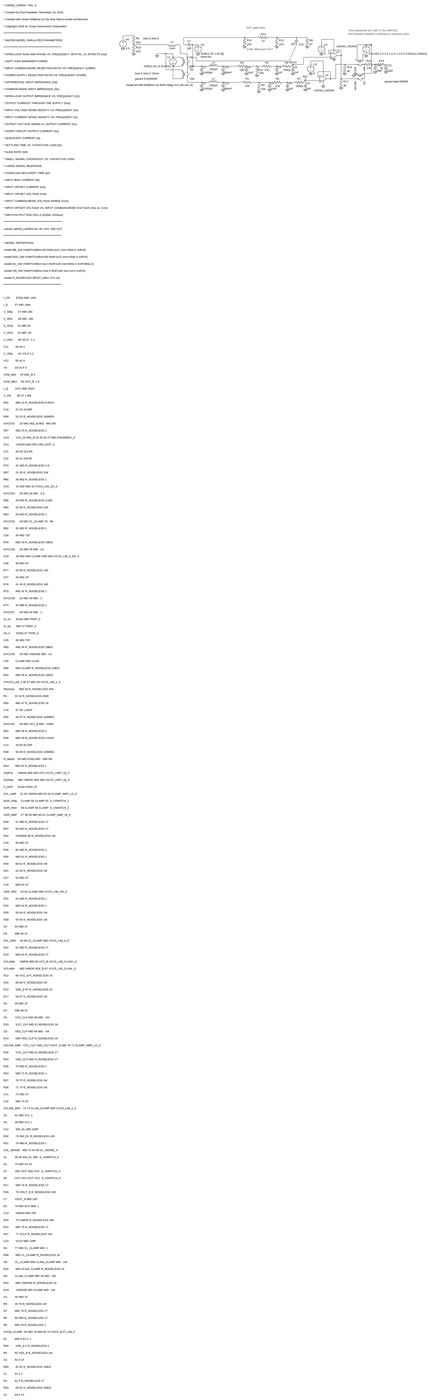
[diagram p0: schematic VNA201 8.asc, whole sheet]
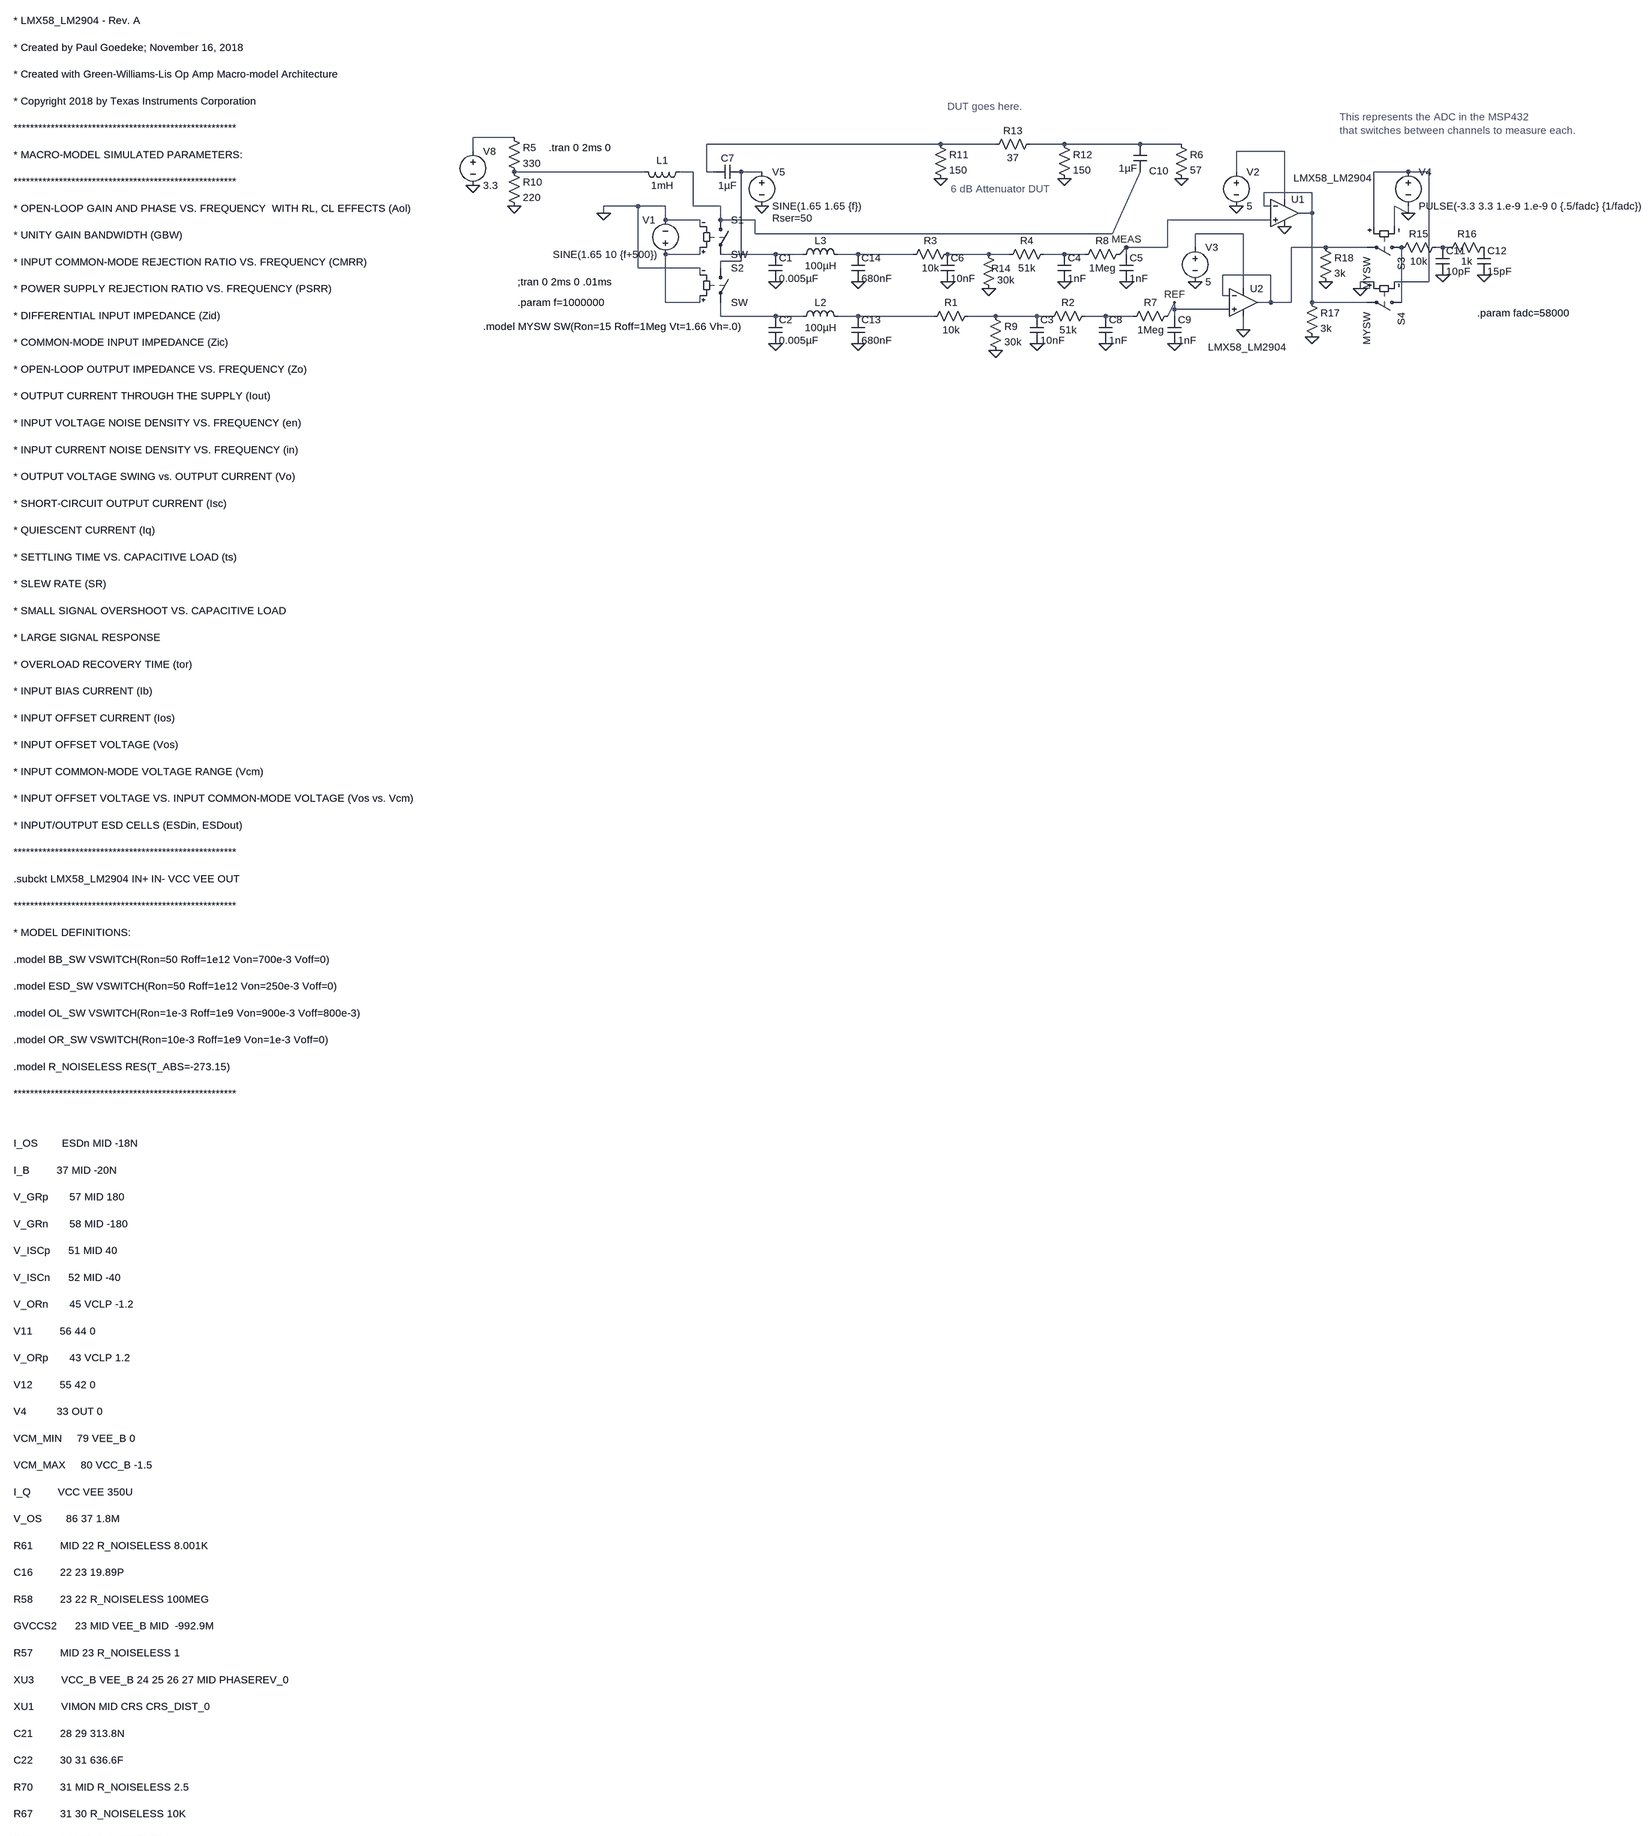
[diagram p1: schematic VNA201 8.asc, part, row 1 of 3, column 1 of 1]
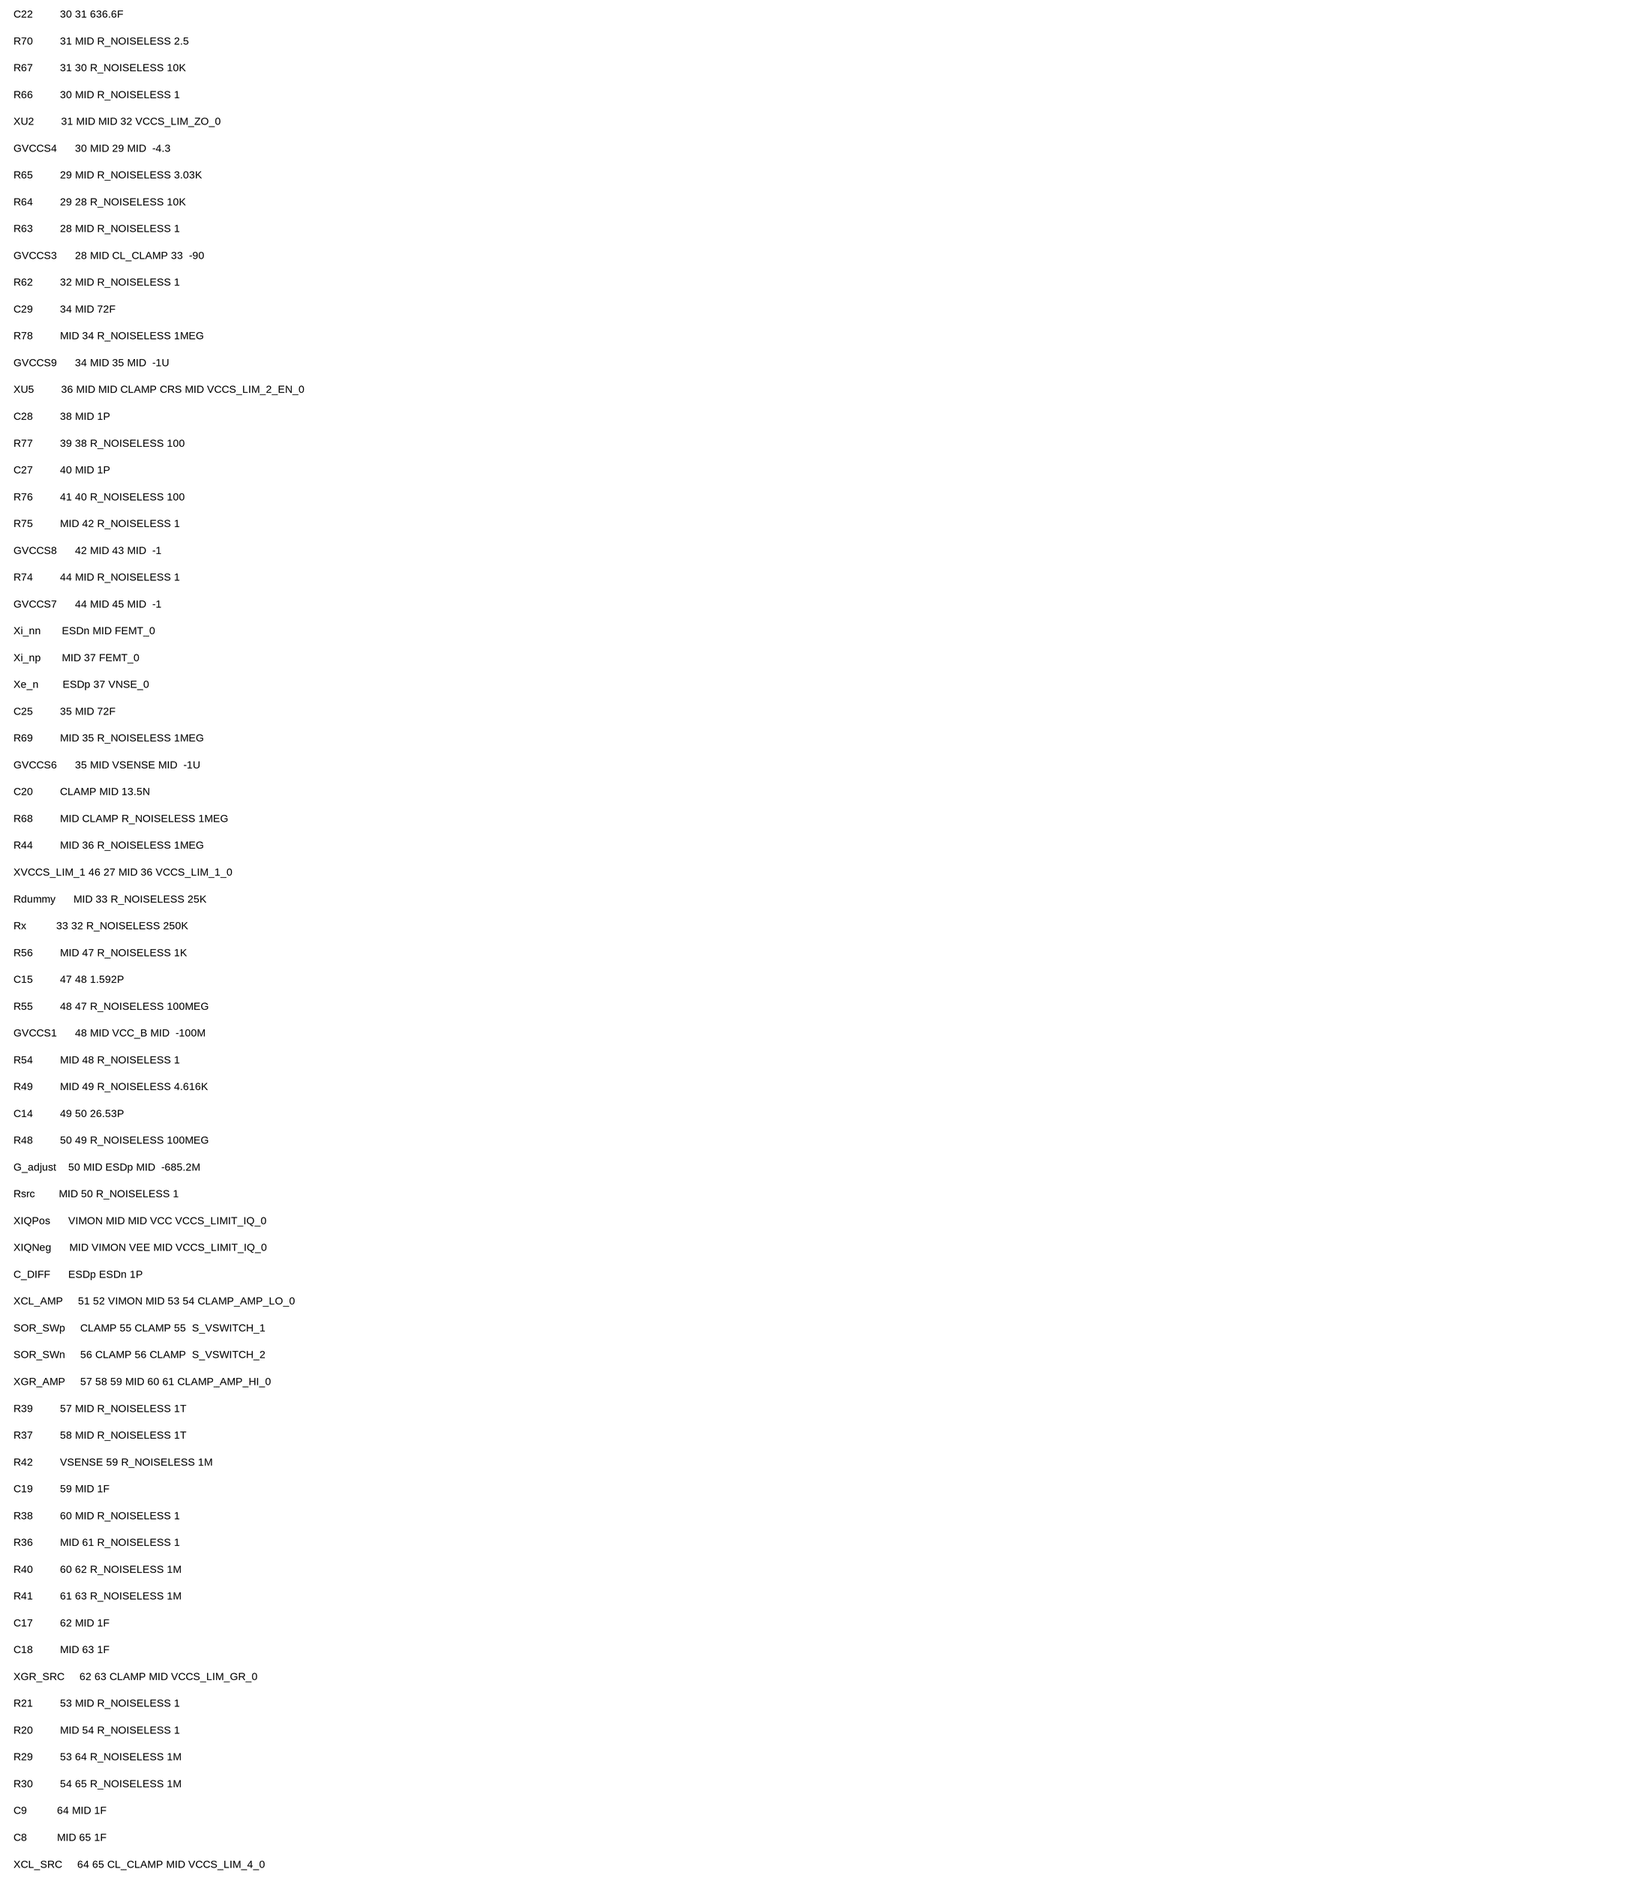
[diagram p2: schematic VNA201 8.asc, part, row 2 of 3, column 1 of 1]
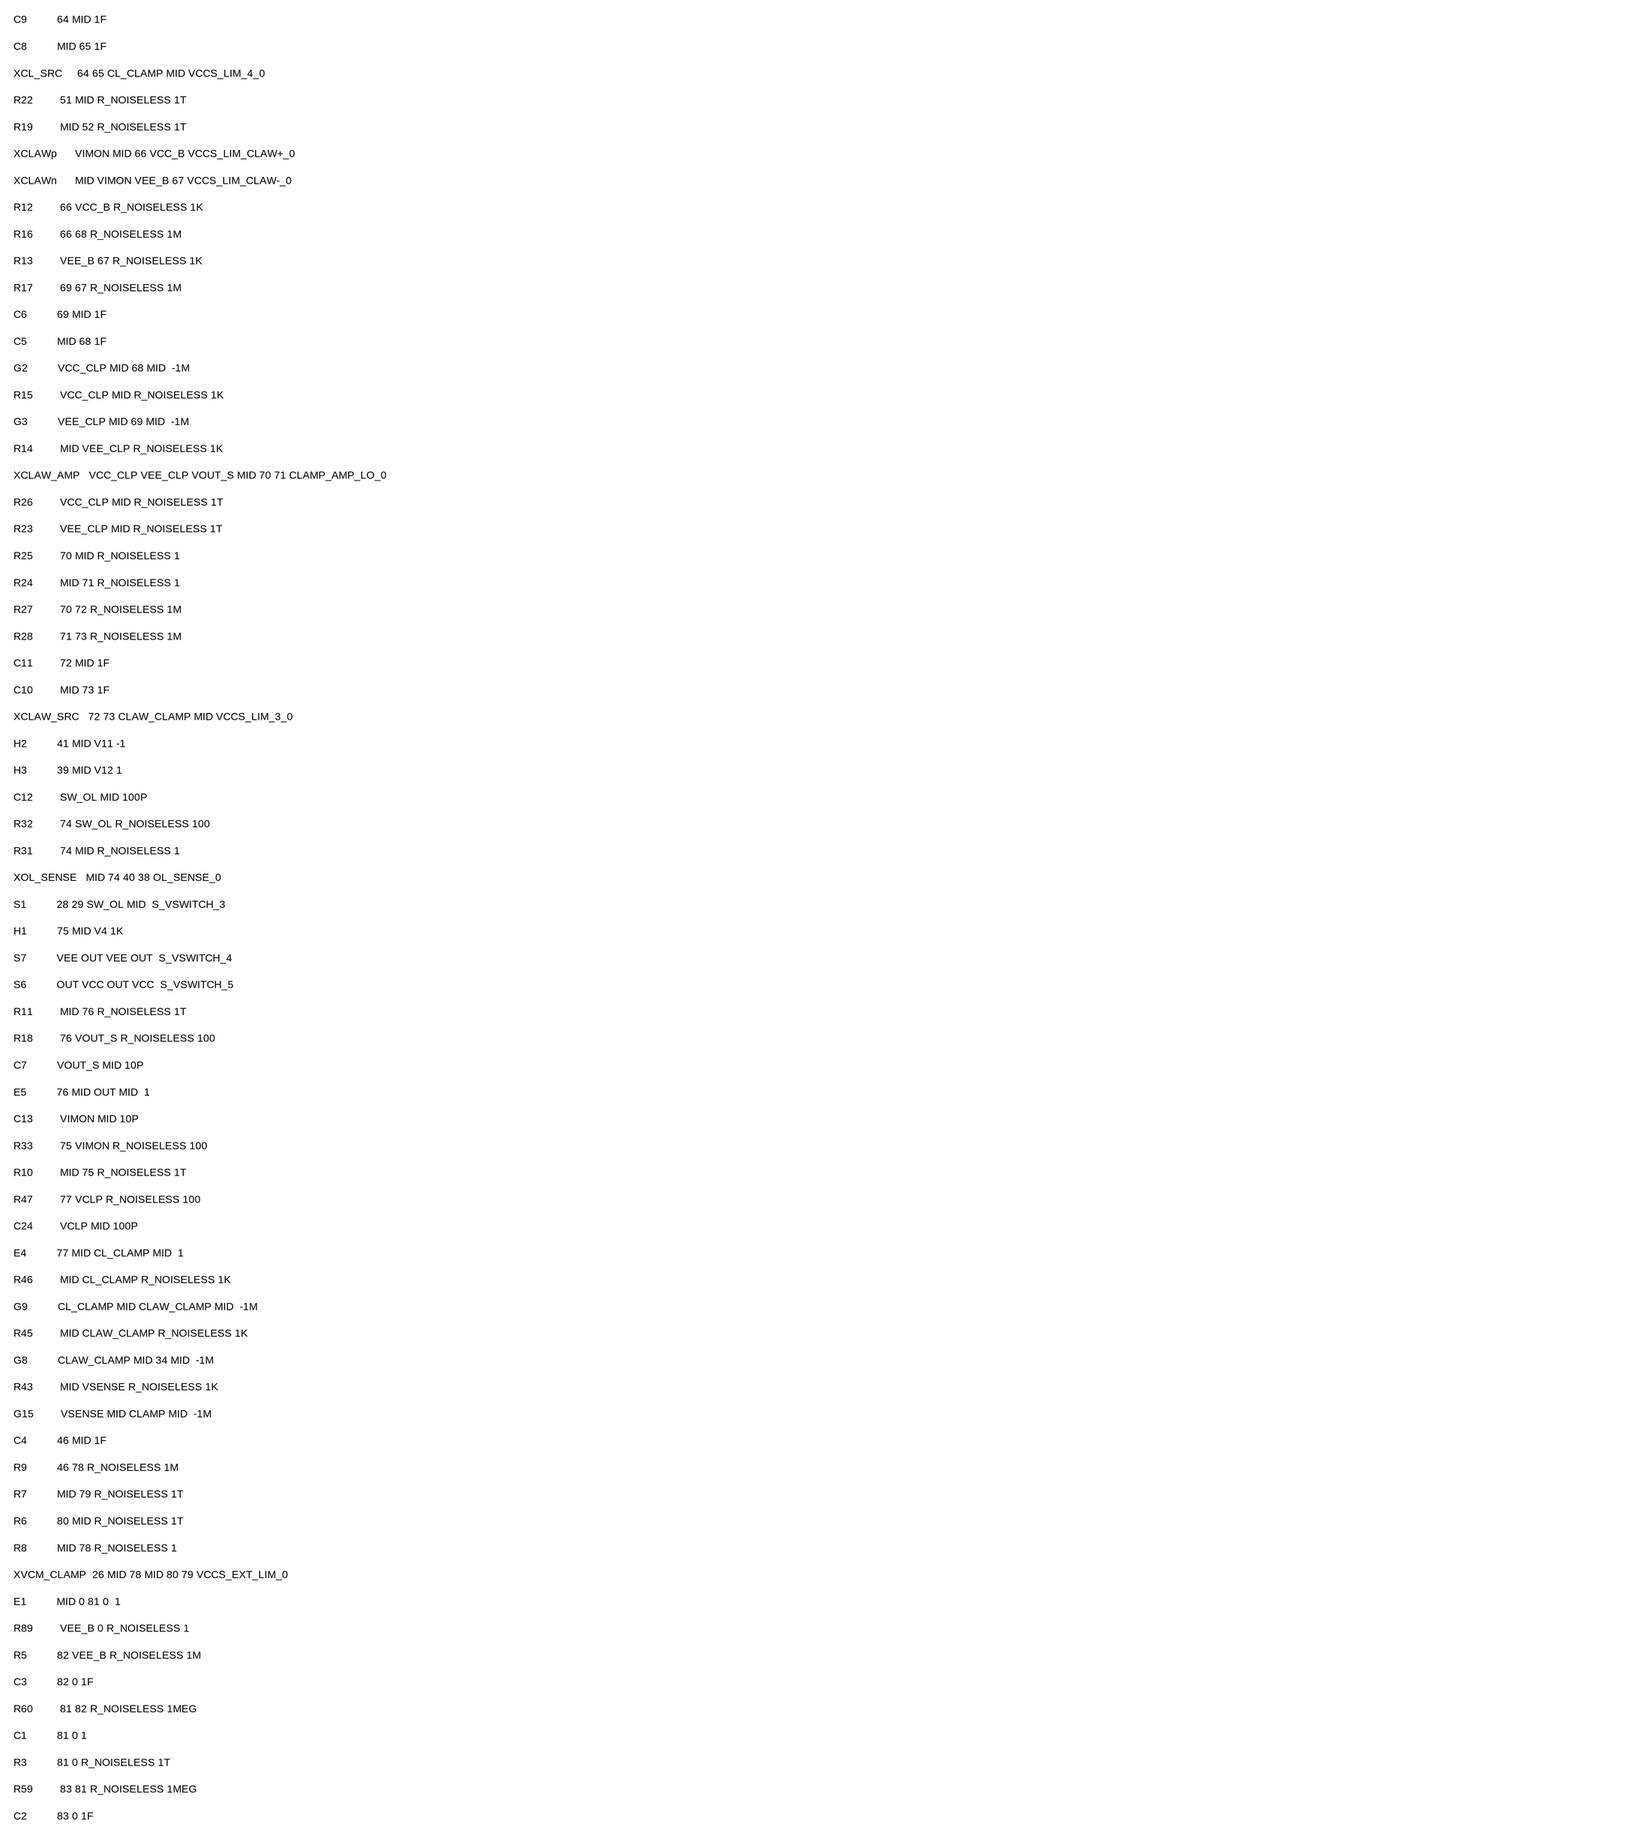
[diagram p3: schematic VNA201 8.asc, part, row 3 of 3, column 1 of 1]
VNA201 8.asc, the LTspice schematic file:
Version 4
SHEET 1 2392 10460
WIRE -624 -96 -720 -96
WIRE 368 -80 -176 -80
WIRE 496 -80 368 -80
WIRE 656 -80 576 -80
WIRE 832 -80 656 -80
WIRE 928 -80 832 -80
WIRE -720 -64 -720 -96
WIRE 1168 -64 1056 -64
WIRE -320 -16 -624 -16
WIRE -208 -16 -240 -16
WIRE -176 -16 -176 -80
WIRE -160 -16 -176 -16
WIRE -48 -16 -96 -16
WIRE 1056 -16 1056 -64
WIRE 1456 -16 1376 -16
WIRE 1504 -16 1456 -16
WIRE 1232 32 1120 32
WIRE 1168 48 1168 -64
WIRE -336 64 -416 64
WIRE -272 64 -336 64
WIRE -208 64 -208 -16
WIRE -144 64 -208 64
WIRE 1120 64 1120 32
WIRE 1136 64 1120 64
WIRE -416 80 -416 64
WIRE 1232 80 1232 32
WIRE 1232 80 1200 80
WIRE 1456 80 1424 64
WIRE 1456 80 1456 64
WIRE -272 96 -272 64
WIRE -192 96 -272 96
WIRE -144 96 -144 64
WIRE -64 96 -144 96
WIRE 1136 96 896 96
WIRE -192 112 -192 96
WIRE 1376 112 1376 -16
WIRE 1424 112 1424 64
WIRE -64 128 -64 96
WIRE 768 128 832 -16
WIRE 768 128 -64 128
WIRE 1072 128 960 128
WIRE 896 160 896 96
WIRE 896 160 800 160
WIRE 960 160 960 128
WIRE 1264 160 1184 160
WIRE 1360 160 1264 160
WIRE 1536 160 1520 160
WIRE 1552 160 1536 160
WIRE -192 176 -192 160
WIRE -192 176 -272 176
WIRE -16 176 -144 176
WIRE 48 176 -16 176
WIRE 176 176 128 176
WIRE 304 176 176 176
WIRE 480 176 384 176
WIRE 528 176 480 176
WIRE 656 176 608 176
WIRE 704 176 656 176
WIRE 784 176 800 160
WIRE 800 176 800 160
WIRE -96 192 -96 -16
WIRE -96 192 -144 192
WIRE -336 208 -336 64
WIRE -192 208 -336 208
WIRE -144 208 -144 192
WIRE -192 224 -192 208
WIRE 1136 224 1024 224
WIRE 1376 240 1344 240
WIRE 1504 240 1504 -16
WIRE 1504 240 1424 240
WIRE 1072 256 1072 128
WIRE 1344 256 1344 240
WIRE 1024 272 1024 224
WIRE 1040 272 1024 272
WIRE -272 288 -272 176
WIRE -192 288 -192 272
WIRE -192 288 -272 288
WIRE 1136 288 1136 224
WIRE 1136 288 1104 288
WIRE 1184 288 1184 160
WIRE 1184 288 1136 288
WIRE 1232 288 1232 80
WIRE 1360 288 1232 288
WIRE 1440 288 1440 160
WIRE 912 304 912 288
WIRE 1040 304 912 304
WIRE -144 320 -144 288
WIRE -16 320 -144 320
WIRE 48 320 -16 320
WIRE 176 320 128 320
WIRE 352 320 176 320
WIRE 496 320 432 320
WIRE 592 320 496 320
WIRE 624 320 592 320
WIRE 752 320 704 320
WIRE 816 320 752 320
WIRE 896 320 912 288
WIRE 912 320 912 304
WIRE 1072 352 1072 320
FLAG -16 384 0
FLAG -48 64 0
FLAG -416 80 0
FLAG -720 16 0
FLAG -16 240 0
FLAG 592 384 0
FLAG 752 384 0
FLAG 912 384 0
FLAG 656 240 0
FLAG 800 240 0
FLAG 384 240 0
FLAG 800 160 MEAS
FLAG 912 288 REF
FLAG -624 64 0
FLAG 656 0 0
FLAG 368 0 0
FLAG 928 0 0
FLAG 496 400 0
FLAG 480 256 0
FLAG 1168 112 0
FLAG 1056 64 0
FLAG 1072 352 0
FLAG 960 240 0
FLAG 1536 224 0
FLAG 1632 224 0
FLAG 1456 80 0
FLAG 1344 256 0
FLAG 1264 240 0
FLAG 1232 368 0
FLAG 176 384 0
FLAG 176 240 0
SYMBOL sw -144 80 R0
SYMATTR InstName S1
SYMATTR SpiceModel MYSW
SYMBOL sw -144 192 R0
SYMATTR InstName S2
SYMATTR SpiceModel MYSW
SYMBOL voltage -272 192 R180
WINDOW 0 24 96 Left 2
WINDOW 3 24 16 Left 2
WINDOW 123 0 0 Left 2
WINDOW 39 0 0 Left 2
SYMATTR InstName V1
SYMATTR Value SINE(1.65 10 {f+500})
SYMBOL cap -32 176 R0
SYMATTR InstName C1
SYMATTR Value 0.005µF
SYMBOL cap -32 320 R0
SYMATTR InstName C2
SYMATTR Value 0.005µF
SYMBOL voltage -48 -32 R0
WINDOW 123 0 0 Left 2
WINDOW 39 24 124 Left 2
SYMATTR SpiceLine Rser=50
SYMATTR InstName V5
SYMATTR Value SINE(1.65 1.65 {f})
SYMBOL res 448 304 R90
WINDOW 0 0 56 VBottom 2
WINDOW 3 32 56 VTop 2
SYMATTR InstName R1
SYMATTR Value 10k
SYMBOL res 400 160 R90
WINDOW 0 0 56 VBottom 2
WINDOW 3 32 56 VTop 2
SYMATTR InstName R3
SYMATTR Value 10k
SYMBOL voltage -720 -80 R0
WINDOW 123 0 0 Left 2
WINDOW 39 0 0 Left 2
SYMATTR InstName V8
SYMATTR Value 3.3
SYMBOL res -640 -112 R0
SYMATTR InstName R5
SYMATTR Value 330
SYMBOL cap -96 -32 R90
WINDOW 0 0 32 VBottom 2
WINDOW 3 32 32 VTop 2
SYMATTR InstName C7
SYMATTR Value 1µF
SYMBOL ind -224 -32 R90
WINDOW 0 5 56 VBottom 2
WINDOW 3 32 56 VTop 2
SYMATTR InstName L1
SYMATTR Value 1mH
SYMATTR SpiceLine Ipk=0.43 Rser=2.58 Rpar=94200 Cpar=0
SYMBOL cap 736 320 R0
SYMATTR InstName C8
SYMATTR Value 1nF
SYMBOL cap 896 320 R0
SYMATTR InstName C9
SYMATTR Value 1nF
SYMBOL res 720 304 R90
WINDOW 0 0 56 VBottom 2
WINDOW 3 32 56 VTop 2
SYMATTR InstName R2
SYMATTR Value 51k
SYMBOL res 912 304 R90
WINDOW 0 0 56 VBottom 2
WINDOW 3 32 56 VTop 2
SYMATTR InstName R7
SYMATTR Value 1Meg
SYMBOL cap 640 176 R0
SYMATTR InstName C4
SYMATTR Value 1nF
SYMBOL cap 784 176 R0
SYMATTR InstName C5
SYMATTR Value 1nF
SYMBOL res 624 160 R90
WINDOW 0 0 56 VBottom 2
WINDOW 3 32 56 VTop 2
SYMATTR InstName R4
SYMATTR Value 51k
SYMBOL res 800 160 R90
WINDOW 0 0 56 VBottom 2
WINDOW 3 32 56 VTop 2
SYMATTR InstName R8
SYMATTR Value 1Meg
SYMBOL cap 368 176 R0
SYMATTR InstName C6
SYMATTR Value 10nF
SYMBOL cap 576 320 R0
SYMATTR InstName C3
SYMATTR Value 10nF
SYMBOL res -640 -32 R0
SYMATTR InstName R10
SYMATTR Value 220
SYMBOL res 352 -96 R0
SYMATTR InstName R11
SYMATTR Value 150
SYMBOL res 640 -96 R0
SYMATTR InstName R12
SYMATTR Value 150
SYMBOL res 592 -96 R90
WINDOW 0 0 56 VBottom 2
WINDOW 3 32 56 VTop 2
SYMATTR InstName R13
SYMATTR Value 37
SYMBOL cap 848 -16 R180
WINDOW 0 -49 2 Left 2
WINDOW 3 24 8 Left 2
SYMATTR InstName C10
SYMATTR Value 1µF
SYMBOL res 912 -96 R0
SYMATTR InstName R6
SYMATTR Value 57
SYMBOL res 480 304 R0
SYMATTR InstName R9
SYMATTR Value 30k
SYMBOL res 464 160 R0
WINDOW 0 22 49 Left 2
SYMATTR InstName R14
SYMATTR Value 30k
SYMBOL Opamps\\opamp2 1168 16 R0
WINDOW 3 21 -18 Left 2
SYMATTR Value LMX58_LM2904
SYMATTR InstName U1
SYMBOL Opamps\\opamp2 1072 224 R0
WINDOW 3 -82 168 Left 2
SYMATTR Value LMX58_LM2904
SYMATTR InstName U2
SYMBOL voltage 1056 -32 R0
WINDOW 123 0 0 Left 0
WINDOW 39 0 0 Left 0
SYMATTR InstName V2
SYMATTR Value 5
SYMBOL voltage 960 144 R0
WINDOW 123 0 0 Left 0
WINDOW 39 0 0 Left 0
SYMATTR InstName V3
SYMATTR Value 5
SYMBOL res 1536 144 R90
WINDOW 0 0 56 VBottom 2
WINDOW 3 32 56 VTop 2
SYMATTR InstName R15
SYMATTR Value 10k
SYMBOL cap 1520 160 R0
SYMATTR InstName C11
SYMATTR Value 10pF
SYMBOL cap 1616 160 R0
SYMATTR InstName C12
SYMATTR Value 15pF
SYMBOL res 1648 144 R90
WINDOW 0 0 56 VBottom 2
WINDOW 3 32 56 VTop 2
SYMATTR InstName R16
SYMATTR Value 1k
SYMBOL sw 1456 160 R90
SYMATTR InstName S3
SYMATTR Value MYSW
SYMBOL sw 1456 288 R90
SYMATTR InstName S4
SYMATTR Value MYSW
SYMBOL voltage 1456 -32 R0
WINDOW 123 0 0 Left 0
WINDOW 39 0 0 Left 0
SYMATTR InstName V4
SYMATTR Value PULSE(-3.3 3.3 1.e-9 1.e-9 0 {.5/fadc} {1/fadc})
SYMBOL res 1216 272 R0
SYMATTR InstName R17
SYMATTR Value 3k
SYMBOL res 1248 144 R0
SYMATTR InstName R18
SYMATTR Value 3k
SYMBOL ind 32 336 R270
WINDOW 0 32 56 VTop 2
WINDOW 3 5 56 VBottom 2
SYMATTR InstName L2
SYMATTR Value 100µH
SYMBOL ind 32 192 R270
WINDOW 0 32 56 VTop 2
WINDOW 3 5 56 VBottom 2
SYMATTR InstName L3
SYMATTR Value 100µH
SYMBOL cap 160 320 R0
SYMATTR InstName C13
SYMATTR Value 680nF
SYMBOL cap 160 176 R0
SYMATTR InstName C14
SYMATTR Value 680nF
TEXT -544 -72 Left 2 !.tran 0 2ms 0
TEXT -616 240 Left 2 !;tran 0 2ms 0 .01ms
TEXT 384 -168 Left 2 ;DUT goes here.
TEXT -616 288 Left 2 !.param f=1000000
TEXT -696 344 Left 2 !.model MYSW SW(Ron=15 Roff=1Meg Vt=1.66 Vh=.0)
TEXT 392 24 Left 2 ;6 dB Attenuator DUT
TEXT -1832 -368 Left 2 !* LMX58_LM2904 - Rev. A\n\n* Created by Paul Goedeke; November 16, 2018\n\n* Created with Green-Williams-Lis Op Amp Macro-model Architecture\n\n* Copyright 2018 by Texas Instruments Corporation\n\n******************************************************\n\n* MACRO-MODEL SIMULATED PARAMETERS:\n\n******************************************************\n\n* OPEN-LOOP GAIN AND PHASE VS. FREQUENCY  WITH RL, CL EFFECTS (Aol)\n\n* UNITY GAIN BANDWIDTH (GBW)\n\n* INPUT COMMON-MODE REJECTION RATIO VS. FREQUENCY (CMRR)\n\n* POWER SUPPLY REJECTION RATIO VS. FREQUENCY (PSRR)\n\n* DIFFERENTIAL INPUT IMPEDANCE (Zid)\n\n* COMMON-MODE INPUT IMPEDANCE (Zic)\n\n* OPEN-LOOP OUTPUT IMPEDANCE VS. FREQUENCY (Zo)\n\n* OUTPUT CURRENT THROUGH THE SUPPLY (Iout)\n\n* INPUT VOLTAGE NOISE DENSITY VS. FREQUENCY (en)\n\n* INPUT CURRENT NOISE DENSITY VS. FREQUENCY (in)\n\n* OUTPUT VOLTAGE SWING vs. OUTPUT CURRENT (Vo)\n\n* SHORT-CIRCUIT OUTPUT CURRENT (Isc)\n\n* QUIESCENT CURRENT (Iq)\n\n* SETTLING TIME VS. CAPACITIVE LOAD (ts)\n\n* SLEW RATE (SR)\n\n* SMALL SIGNAL OVERSHOOT VS. CAPACITIVE LOAD\n\n* LARGE SIGNAL RESPONSE\n\n* OVERLOAD RECOVERY TIME (tor)\n\n* INPUT BIAS CURRENT (Ib)\n\n* INPUT OFFSET CURRENT (Ios)\n\n* INPUT OFFSET VOLTAGE (Vos)\n\n* INPUT COMMON-MODE VOLTAGE RANGE (Vcm)\n\n* INPUT OFFSET VOLTAGE VS. INPUT COMMON-MODE VOLTAGE (Vos vs. Vcm)\n\n* INPUT/OUTPUT ESD CELLS (ESDin, ESDout)\n\n******************************************************\n\n.subckt LMX58_LM2904 IN+ IN- VCC VEE OUT\n\n******************************************************\n\n* MODEL DEFINITIONS:\n\n.model BB_SW VSWITCH(Ron=50 Roff=1e12 Von=700e-3 Voff=0)\n\n.model ESD_SW VSWITCH(Ron=50 Roff=1e12 Von=250e-3 Voff=0)\n\n.model OL_SW VSWITCH(Ron=1e-3 Roff=1e9 Von=900e-3 Voff=800e-3)\n\n.model OR_SW VSWITCH(Ron=10e-3 Roff=1e9 Von=1e-3 Voff=0)\n\n.model R_NOISELESS RES(T_ABS=-273.15)\n\n******************************************************\n\n\n\n\nI_OS        ESDn MID -18N\n\nI_B         37 MID -20N\n\nV_GRp       57 MID 180\n\nV_GRn       58 MID -180\n\nV_ISCp      51 MID 40\n\nV_ISCn      52 MID -40\n\nV_ORn       45 VCLP -1.2\n\nV11         56 44 0\n\nV_ORp       43 VCLP 1.2\n\nV12         55 42 0\n\nV4          33 OUT 0\n\nVCM_MIN     79 VEE_B 0\n\nVCM_MAX     80 VCC_B -1.5\n\nI_Q         VCC VEE 350U\n\nV_OS        86 37 1.8M\n\nR61         MID 22 R_NOISELESS 8.001K \n\nC16         22 23 19.89P \n\nR58         23 22 R_NOISELESS 100MEG \n\nGVCCS2      23 MID VEE_B MID  -992.9M\n\nR57         MID 23 R_NOISELESS 1 \n\nXU3         VCC_B VEE_B 24 25 26 27 MID PHASEREV_0\n\nXU1         VIMON MID CRS CRS_DIST_0\n\nC21         28 29 313.8N  \n\nC22         30 31 636.6F  \n\nR70         31 MID R_NOISELESS 2.5 \n\nR67         31 30 R_NOISELESS 10K \n\nR66         30 MID R_NOISELESS 1 \n\nXU2         31 MID MID 32 VCCS_LIM_ZO_0\n\nGVCCS4      30 MID 29 MID  -4.3\n\nR65         29 MID R_NOISELESS 3.03K \n\nR64         29 28 R_NOISELESS 10K \n\nR63         28 MID R_NOISELESS 1 \n\nGVCCS3      28 MID CL_CLAMP 33  -90\n\nR62         32 MID R_NOISELESS 1 \n\nC29         34 MID 72F \n\nR78         MID 34 R_NOISELESS 1MEG \n\nGVCCS9      34 MID 35 MID  -1U\n\nXU5         36 MID MID CLAMP CRS MID VCCS_LIM_2_EN_0\n\nC28         38 MID 1P \n\nR77         39 38 R_NOISELESS 100 \n\nC27         40 MID 1P \n\nR76         41 40 R_NOISELESS 100 \n\nR75         MID 42 R_NOISELESS 1 \n\nGVCCS8      42 MID 43 MID  -1\n\nR74         44 MID R_NOISELESS 1 \n\nGVCCS7      44 MID 45 MID  -1\n\nXi_nn       ESDn MID FEMT_0\n\nXi_np       MID 37 FEMT_0\n\nXe_n        ESDp 37 VNSE_0\n\nC25         35 MID 72F \n\nR69         MID 35 R_NOISELESS 1MEG \n\nGVCCS6      35 MID VSENSE MID  -1U\n\nC20         CLAMP MID 13.5N \n\nR68         MID CLAMP R_NOISELESS 1MEG \n\nR44         MID 36 R_NOISELESS 1MEG \n\nXVCCS_LIM_1 46 27 MID 36 VCCS_LIM_1_0\n\nRdummy      MID 33 R_NOISELESS 25K \n\nRx          33 32 R_NOISELESS 250K \n\nR56         MID 47 R_NOISELESS 1K \n\nC15         47 48 1.592P \n\nR55         48 47 R_NOISELESS 100MEG \n\nGVCCS1      48 MID VCC_B MID  -100M\n\nR54         MID 48 R_NOISELESS 1 \n\nR49         MID 49 R_NOISELESS 4.616K \n\nC14         49 50 26.53P \n\nR48         50 49 R_NOISELESS 100MEG \n\nG_adjust    50 MID ESDp MID  -685.2M\n\nRsrc        MID 50 R_NOISELESS 1 \n\nXIQPos      VIMON MID MID VCC VCCS_LIMIT_IQ_0\n\nXIQNeg      MID VIMON VEE MID VCCS_LIMIT_IQ_0\n\nC_DIFF      ESDp ESDn 1P \n\nXCL_AMP     51 52 VIMON MID 53 54 CLAMP_AMP_LO_0\n\nSOR_SWp     CLAMP 55 CLAMP 55  S_VSWITCH_1\n\nSOR_SWn     56 CLAMP 56 CLAMP  S_VSWITCH_2\n\nXGR_AMP     57 58 59 MID 60 61 CLAMP_AMP_HI_0\n\nR39         57 MID R_NOISELESS 1T \n\nR37         58 MID R_NOISELESS 1T \n\nR42         VSENSE 59 R_NOISELESS 1M \n\nC19         59 MID 1F \n\nR38         60 MID R_NOISELESS 1 \n\nR36         MID 61 R_NOISELESS 1 \n\nR40         60 62 R_NOISELESS 1M \n\nR41         61 63 R_NOISELESS 1M \n\nC17         62 MID 1F \n\nC18         MID 63 1F \n\nXGR_SRC     62 63 CLAMP MID VCCS_LIM_GR_0\n\nR21         53 MID R_NOISELESS 1 \n\nR20         MID 54 R_NOISELESS 1 \n\nR29         53 64 R_NOISELESS 1M \n\nR30         54 65 R_NOISELESS 1M \n\nC9          64 MID 1F \n\nC8          MID 65 1F \n\nXCL_SRC     64 65 CL_CLAMP MID VCCS_LIM_4_0\n\nR22         51 MID R_NOISELESS 1T \n\nR19         MID 52 R_NOISELESS 1T \n\nXCLAWp      VIMON MID 66 VCC_B VCCS_LIM_CLAW+_0\n\nXCLAWn      MID VIMON VEE_B 67 VCCS_LIM_CLAW-_0\n\nR12         66 VCC_B R_NOISELESS 1K \n\nR16         66 68 R_NOISELESS 1M \n\nR13         VEE_B 67 R_NOISELESS 1K \n\nR17         69 67 R_NOISELESS 1M \n\nC6          69 MID 1F \n\nC5          MID 68 1F \n\nG2          VCC_CLP MID 68 MID  -1M\n\nR15         VCC_CLP MID R_NOISELESS 1K \n\nG3          VEE_CLP MID 69 MID  -1M\n\nR14         MID VEE_CLP R_NOISELESS 1K \n\nXCLAW_AMP   VCC_CLP VEE_CLP VOUT_S MID 70 71 CLAMP_AMP_LO_0\n\nR26         VCC_CLP MID R_NOISELESS 1T \n\nR23         VEE_CLP MID R_NOISELESS 1T \n\nR25         70 MID R_NOISELESS 1 \n\nR24         MID 71 R_NOISELESS 1 \n\nR27         70 72 R_NOISELESS 1M \n\nR28         71 73 R_NOISELESS 1M \n\nC11         72 MID 1F \n\nC10         MID 73 1F \n\nXCLAW_SRC   72 73 CLAW_CLAMP MID VCCS_LIM_3_0\n\nH2          41 MID V11 -1\n\nH3          39 MID V12 1\n\nC12         SW_OL MID 100P \n\nR32         74 SW_OL R_NOISELESS 100 \n\nR31         74 MID R_NOISELESS 1 \n\nXOL_SENSE   MID 74 40 38 OL_SENSE_0\n\nS1          28 29 SW_OL MID  S_VSWITCH_3\n\nH1          75 MID V4 1K\n\nS7          VEE OUT VEE OUT  S_VSWITCH_4\n\nS6          OUT VCC OUT VCC  S_VSWITCH_5\n\nR11         MID 76 R_NOISELESS 1T \n\nR18         76 VOUT_S R_NOISELESS 100 \n\nC7          VOUT_S MID 10P \n\nE5          76 MID OUT MID  1\n\nC13         VIMON MID 10P \n\nR33         75 VIMON R_NOISELESS 100 \n\nR10         MID 75 R_NOISELESS 1T \n\nR47         77 VCLP R_NOISELESS 100 \n\nC24         VCLP MID 100P \n\nE4          77 MID CL_CLAMP MID  1\n\nR46         MID CL_CLAMP R_NOISELESS 1K \n\nG9          CL_CLAMP MID CLAW_CLAMP MID  -1M\n\nR45         MID CLAW_CLAMP R_NOISELESS 1K \n\nG8          CLAW_CLAMP MID 34 MID  -1M\n\nR43         MID VSENSE R_NOISELESS 1K \n\nG15         VSENSE MID CLAMP MID  -1M\n\nC4          46 MID 1F \n\nR9          46 78 R_NOISELESS 1M \n\nR7          MID 79 R_NOISELESS 1T \n\nR6          80 MID R_NOISELESS 1T \n\nR8          MID 78 R_NOISELESS 1 \n\nXVCM_CLAMP  26 MID 78 MID 80 79 VCCS_EXT_LIM_0\n\nE1          MID 0 81 0  1\n\nR89         VEE_B 0 R_NOISELESS 1 \n\nR5          82 VEE_B R_NOISELESS 1M \n\nC3          82 0 1F \n\nR60         81 82 R_NOISELESS 1MEG \n\nC1          81 0 1 \n\nR3          81 0 R_NOISELESS 1T \n\nR59         83 81 R_NOISELESS 1MEG \n\nC2          83 0 1F \n\nR4          VCC_B 83 R_NOISELESS 1M \n\nR88         VCC_B 0 R_NOISELESS 1 \n\nG17         VEE_B 0 VEE 0  -1\n\nG16         VCC_B 0 VCC 0  -1\n\nR_PSR       84 24 R_NOISELESS 1K \n\nG_PSR       24 84 47 22  -1M\n\nR2          25 ESDn R_NOISELESS 1M \n\nR1          84 85 R_NOISELESS 1M \n\nR_CMR       86 85 R_NOISELESS 1K \n\nG_CMR       85 86 49 MID  -1M\n\nC_CMn       ESDn MID 2P \n\nC_CMp       MID ESDp 2P \n\nR53         ESDn MID R_NOISELESS 1T \n\nR52         MID ESDp R_NOISELESS 1T \n\nR35         IN- ESDn R_NOISELESS 10M \n\nR34         IN+ ESDp R_NOISELESS 10M \n\n\n.MODEL S_VSWITCH_1 VSWITCH (RON=10M ROFF=1T VON=10M VOFF=0)\n\n.MODEL S_VSWITCH_2 VSWITCH (RON=10M ROFF=1T VON=10M VOFF=0)\n\n.MODEL S_VSWITCH_3 VSWITCH (RON=1M ROFF=1T VON=500M VOFF=100M)\n\n.MODEL S_VSWITCH_4 VSWITCH (RON=50 ROFF=1T VON=500M VOFF=450M)\n\n.MODEL S_VSWITCH_5 VSWITCH (RON=50 ROFF=1T VON=500M VOFF=450M)\n\n\n.ENDS LMX58_LM2904\n\n*\n\n.SUBCKT PHASEREV_0  VCC VEE VIN+ VIN- VOUT+ VOUT- MID\n\nE1 VOUT+ MID VALUE={IF(V(VIN+,MID)<V(VEE,MID)-0.3,V(VCC,MID),V(VIN+,MID))}\n\nE2 VOUT- MID VALUE={IF(V(VIN-,MID)<V(VEE,MID)-0.3,V(VCC,MID),V(VIN-,MID))}\n\n.ENDS\n\n*\n\n\n\n\n.SUBCKT CRS_DIST_0  VIMON MID OUT\n\nV1 VREF MID -40M\n\nESHF VSHF MID VIMON VREF 1\n\nGZC MID ZC VALUE = {SGN(V(VSHF,MID))}\n\nR1 ZC MID 1\n\nC1 ZC MID 2U\n\nGCR MID OUT VALUE = {IF((ABS(V(ZC,MID))<=0.9),0,1)}\n\nR2 OUT MID 1\n\n.ENDS\n\n*\n\n\n\n\n.SUBCKT VCCS_LIM_ZO_0  VC+ VC- IOUT+ IOUT-\n\n.PARAM GAIN = 4E3\n\n.PARAM IPOS = 1E6\n\n.PARAM INEG = -1E6\n\nG1 IOUT+ IOUT- VALUE={LIMIT(GAIN*V(VC+,VC-),INEG,IPOS)}\n\n.ENDS\n\n*\n\n\n\n\n.SUBCKT VCCS_LIM_2_EN_0  VC+ VC- IOUT+ IOUT- EN MID\n\n.PARAM GAIN = 8.4E-4\n\n.PARAM IPOS = 0.005\n\n.PARAM INEG = -0.005\n\nG1 IOUT+ IOUT- VALUE={LIMIT(GAIN*V(EN,MID)*V(VC+,VC-),INEG,IPOS)}\n\n.ENDS\n\n*\n\n\n\n\n.SUBCKT FEMT_0  1 2\n\n.PARAM FLWF=1E-3\n\n.PARAM NLFF=500\n\n.PARAM NVRF=500\n\n.PARAM GLFF={PWR(FLWF,0.25)*NLFF/1164}\n\n.PARAM RNVF={1.184*PWR(NVRF,2)}\n\n.MODEL DVNF D KF={PWR(FLWF,0.5)/1E11} IS=1.0E-16\n\nI1 0 7 10E-3\n\nI2 0 8 10E-3\n\nD1 7 0 DVNF\n\nD2 8 0 DVNF\n\nE1 3 6 7 8 {GLFF}\n\nR1 3 0 1E9\n\nR2 3 0 1E9\n\nR3 3 6 1E9\n\nE2 6 4 5 0 10\n\nR4 5 0 {RNVF}\n\nR5 5 0 {RNVF}\n\nR6 3 4 1E9\n\nR7 4 0 1E9\n\nG1 1 2 3 4 1E-6\n\n.ENDS\n\n*\n\n\n\n\n.SUBCKT VNSE_0  1 2\n\n.PARAM FLW=10\n\n.PARAM NLF=80\n\n.PARAM NVR=35\n\n.PARAM GLF={PWR(FLW,0.25)*NLF/1164}\n\n.PARAM RNV={1.184*PWR(NVR,2)}\n\n.MODEL DVN D KF={PWR(FLW,0.5)/1E11} IS=1.0E-16\n\nI1 0 7 10E-3\n\nI2 0 8 10E-3\n\nD1 7 0 DVN\n\nD2 8 0 DVN\n\nE1 3 6 7 8 {GLF}\n\nR1 3 0 1E9\n\nR2 3 0 1E9\n\nR3 3 6 1E9\n\nE2 6 4 5 0 10\n\nR4 5 0 {RNV}\n\nR5 5 0 {RNV}\n\nR6 3 4 1E9\n\nR7 4 0 1E9\n\nE3 1 2 3 4 1\n\n.ENDS\n\n*\n\n\n\n\n.SUBCKT VCCS_LIM_1_0  VC+ VC- IOUT+ IOUT-\n\n.PARAM GAIN = 1E-4\n\n.PARAM IPOS = .5\n\n.PARAM INEG = -.5\n\nG1 IOUT+ IOUT- VALUE={LIMIT(GAIN*V(VC+,VC-),INEG,IPOS)}\n\n.ENDS\n\n*\n\n\n\n\n.SUBCKT VCCS_LIMIT_IQ_0  VC+ VC- IOUT+ IOUT-\n\n.PARAM GAIN = 1E-3\n\nG1 IOUT- IOUT+ VALUE={IF( (V(VC+,VC-)<=0),0,GAIN*V(VC+,VC-) )}\n\n.ENDS\n\n*\n\n\n\n\n.SUBCKT CLAMP_AMP_LO_0  VC+ VC- VIN COM VO+ VO-\n\n.PARAM G=1\n\nGVO+ COM VO+ VALUE = {IF(V(VIN,COM)>V(VC+,COM),((V(VIN,COM)-V(VC+,COM))*G),0)}\n\nGVO- COM VO- VALUE = {IF(V(VIN,COM)<V(VC-,COM),((V(VC-,COM)-V(VIN,COM))*G),0)}\n\n.ENDS\n\n*\n\n\n\n\n.SUBCKT CLAMP_AMP_HI_0  VC+ VC- VIN COM VO+ VO-\n\n.PARAM G=10\n\nGVO+ COM VO+ VALUE = {IF(V(VIN,COM)>V(VC+,COM),((V(VIN,COM)-V(VC+,COM))*G),0)}\n\nGVO- COM VO- VALUE = {IF(V(VIN,COM)<V(VC-,COM),((V(VC-,COM)-V(VIN,COM))*G),0)}\n\n.ENDS\n\n*\n\n\n\n\n.SUBCKT VCCS_LIM_GR_0  VC+ VC- IOUT+ IOUT-\n\n.PARAM GAIN = 1\n\n.PARAM IPOS = 0.013\n\n.PARAM INEG = -0.013\n\nG1 IOUT+ IOUT- VALUE={LIMIT(GAIN*V(VC+,VC-),INEG,IPOS)}\n\n.ENDS\n\n*\n\n\n\n\n.SUBCKT VCCS_LIM_4_0  VC+ VC- IOUT+ IOUT-\n\n.PARAM GAIN = 1\n\n.PARAM IPOS = 1.04\n\n.PARAM INEG = -1.04\n\nG1 IOUT+ IOUT- VALUE={LIMIT(GAIN*V(VC+,VC-),INEG,IPOS)}\n\n.ENDS\n\n*\n\n\n\n\n.SUBCKT VCCS_LIM_CLAW+_0  VC+ VC- IOUT+ IOUT-\n\nG1 IOUT+ IOUT- TABLE {ABS(V(VC+,VC-))} =\n\n+(0, 1.17E-03)\n\n+(0.0046251, 1.17E-3)\n\n+(0.15716, 1.21E-3)\n\n+(1.3309, 1.28E-3)\n\n+(35.075, 2.12E-3)\n\n+(35.680, 2.55E-3)\n\n+(36.033, 2.84E-3)\n\n+(37.416, 7.97E-3)\n\n.ENDS\n\n*\n\n\n\n\n.SUBCKT VCCS_LIM_CLAW-_0  VC+ VC- IOUT+ IOUT-\n\nG1 IOUT+ IOUT- TABLE {ABS(V(VC+,VC-))} =\n\n+(0.010, 2.50E-5)\n\n+(0.070, 2.50E-5)\n\n+(0.090, 5.80E-4)\n\n+(0.100, 6.06E-4)\n\n+(0.760, 7.14E-4) \n\n+(1.440, 7.62E-4)\n\n+(8.000, 1.10E-3)\n\n+(13.60, 1.55E-3)\n\n+(15.45, 1.75E-3)\n\n+(17.26, 2.15E-3)\n\n+(18.87, 2.94E-3)\n\n+(21.58, 4.50E-3)\n\n+(25.53, 1.02E-2)\n\n.ENDS\n\n*\n\n\n\n\n\n.SUBCKT VCCS_LIM_3_0  VC+ VC- IOUT+ IOUT-\n\n.PARAM GAIN = 1\n\n.PARAM IPOS = 0.435\n\n.PARAM INEG = -0.435\n\nG1 IOUT+ IOUT- VALUE={LIMIT(GAIN*V(VC+,VC-),INEG,IPOS)}\n\n.ENDS\n\n*\n\n\n\n\n.SUBCKT OL_SENSE_0  COM SW+ OLN  OLP\n\nGSW+ COM SW+ VALUE = {IF((V(OLN,COM)>10E-3 | V(OLP,COM)>10E-3),1,0)}\n\n.ENDS\n\n*\n\n\n\n\n.SUBCKT VCCS_EXT_LIM_0  VIN+ VIN- IOUT- IOUT+ VP+ VP-\n\n.PARAM GAIN = 1\n\nG1 IOUT+ IOUT- VALUE={LIMIT(GAIN*V(VIN+,VIN-),V(VP-,VIN-), V(VP+,VIN-))}\n\n.ENDS\n\n*
TEXT 1296 -144 Left 2 ;This represents the ADC in the MSP432 \nthat switches between channels to measure each.
TEXT 1616 312 Left 2 !.param fadc=58000

The netlist it stands for:
* VNA201 8.asc
S1 N006 N014 N013 0 MYSW SW
S2 N007 N019 N013 0 MYSW SW
V1 N013 0 SINE(1.65 10 {f+500})
C1 N014 0 0.005µF
C2 N019 0 0.005µF
V5 N007 0 SINE(1.65 1.65 {f}) Rser=50
R1 N021 N020 10k
R3 N016 N015 10k
V8 N001 0 3.3
R5 N001 N005 330
C7 N007 N002 1µF
L1 N006 N005 1mH Ipk=0.43 Rser=2.58 Rpar=94200 Cpar=0
C8 N022 0 1nF
C9 REF 0 1nF
R2 N022 N021 51k
R7 REF N022 1Meg
C4 N017 0 1nF
C5 MEAS 0 1nF
R4 N017 N016 51k
R8 MEAS N017 1Meg
C6 N016 0 10nF
C3 N021 0 10nF
R10 N005 0 220
R11 N002 0 150
R12 N003 0 150
R13 N003 N002 37
C10 N006 N003 1µF
R6 N003 0 57
R9 N021 0 30k
R14 N016 0 30k
XU1 MEAS N009 N004 0 N009 LMX58_LM2904  ; pins In+ In- V+ V- OUT
XU2 REF N011 N010 0 N011 LMX58_LM2904  ; pins In+ In- V+ V- OUT
V2 N004 0 5
V3 N010 0 5
R15 N012 N018 10k
C11 N012 0 10pF
C12 P001 0 15pF
R16 P001 N012 1k
S3 N018 N011 N008 0 MYSW
S4 N018 N009 0 N008 MYSW
V4 N008 0 PULSE(-3.3 3.3 1.e-9 1.e-9 0 {.5/fadc} {1/fadc})
R17 N009 0 3k
R18 N011 0 3k
L2 N019 N020 100µH
L3 N014 N015 100µH
C13 N020 0 680nF
C14 N015 0 680nF
.tran 0 2ms 0
;tran 0 2ms 0 .01ms
* DUT goes here.
.param f=1000000
.model MYSW SW(Ron=15 Roff=1Meg Vt=1.66 Vh=.0)
* 6 dB Attenuator DUT
* LMX58_LM2904 - Rev. A
* Created by Paul Goedeke; November 16, 2018
* Created with Green-Williams-Lis Op Amp Macro-model Architecture
* Copyright 2018 by Texas Instruments Corporation
******************************************************
* MACRO-MODEL SIMULATED PARAMETERS:
******************************************************
* OPEN-LOOP GAIN AND PHASE VS. FREQUENCY  WITH RL, CL EFFECTS (Aol)
* UNITY GAIN BANDWIDTH (GBW)
* INPUT COMMON-MODE REJECTION RATIO VS. FREQUENCY (CMRR)
* POWER SUPPLY REJECTION RATIO VS. FREQUENCY (PSRR)
* DIFFERENTIAL INPUT IMPEDANCE (Zid)
* COMMON-MODE INPUT IMPEDANCE (Zic)
* OPEN-LOOP OUTPUT IMPEDANCE VS. FREQUENCY (Zo)
* OUTPUT CURRENT THROUGH THE SUPPLY (Iout)
* INPUT VOLTAGE NOISE DENSITY VS. FREQUENCY (en)
* INPUT CURRENT NOISE DENSITY VS. FREQUENCY (in)
* OUTPUT VOLTAGE SWING vs. OUTPUT CURRENT (Vo)
* SHORT-CIRCUIT OUTPUT CURRENT (Isc)
* QUIESCENT CURRENT (Iq)
* SETTLING TIME VS. CAPACITIVE LOAD (ts)
* SLEW RATE (SR)
* SMALL SIGNAL OVERSHOOT VS. CAPACITIVE LOAD
* LARGE SIGNAL RESPONSE
* OVERLOAD RECOVERY TIME (tor)
* INPUT BIAS CURRENT (Ib)
* INPUT OFFSET CURRENT (Ios)
* INPUT OFFSET VOLTAGE (Vos)
* INPUT COMMON-MODE VOLTAGE RANGE (Vcm)
* INPUT OFFSET VOLTAGE VS. INPUT COMMON-MODE VOLTAGE (Vos vs. Vcm)
* INPUT/OUTPUT ESD CELLS (ESDin, ESDout)
******************************************************
.subckt LMX58_LM2904 IN+ IN- VCC VEE OUT
******************************************************
* MODEL DEFINITIONS:
.model BB_SW VSWITCH(Ron=50 Roff=1e12 Von=700e-3 Voff=0)
.model ESD_SW VSWITCH(Ron=50 Roff=1e12 Von=250e-3 Voff=0)
.model OL_SW VSWITCH(Ron=1e-3 Roff=1e9 Von=900e-3 Voff=800e-3)
.model OR_SW VSWITCH(Ron=10e-3 Roff=1e9 Von=1e-3 Voff=0)
.model R_NOISELESS RES(T_ABS=-273.15)
******************************************************
I_OS        ESDn MID -18N
I_B         37 MID -20N
V_GRp       57 MID 180
V_GRn       58 MID -180
V_ISCp      51 MID 40
V_ISCn      52 MID -40
V_ORn       45 VCLP -1.2
V11         56 44 0
V_ORp       43 VCLP 1.2
V12         55 42 0
V4          33 OUT 0
VCM_MIN     79 VEE_B 0
VCM_MAX     80 VCC_B -1.5
I_Q         VCC VEE 350U
V_OS        86 37 1.8M
R61         MID 22 R_NOISELESS 8.001K
C16         22 23 19.89P
R58         23 22 R_NOISELESS 100MEG
GVCCS2      23 MID VEE_B MID  -992.9M
R57         MID 23 R_NOISELESS 1
XU3         VCC_B VEE_B 24 25 26 27 MID PHASEREV_0
XU1         VIMON MID CRS CRS_DIST_0
C21         28 29 313.8N
C22         30 31 636.6F
R70         31 MID R_NOISELESS 2.5
R67         31 30 R_NOISELESS 10K
R66         30 MID R_NOISELESS 1
XU2         31 MID MID 32 VCCS_LIM_ZO_0
GVCCS4      30 MID 29 MID  -4.3
R65         29 MID R_NOISELESS 3.03K
R64         29 28 R_NOISELESS 10K
R63         28 MID R_NOISELESS 1
GVCCS3      28 MID CL_CLAMP 33  -90
R62         32 MID R_NOISELESS 1
C29         34 MID 72F
R78         MID 34 R_NOISELESS 1MEG
GVCCS9      34 MID 35 MID  -1U
XU5         36 MID MID CLAMP CRS MID VCCS_LIM_2_EN_0
C28         38 MID 1P
R77         39 38 R_NOISELESS 100
C27         40 MID 1P
R76         41 40 R_NOISELESS 100
R75         MID 42 R_NOISELESS 1
GVCCS8      42 MID 43 MID  -1
R74         44 MID R_NOISELESS 1
GVCCS7      44 MID 45 MID  -1
Xi_nn       ESDn MID FEMT_0
Xi_np       MID 37 FEMT_0
Xe_n        ESDp 37 VNSE_0
C25         35 MID 72F
R69         MID 35 R_NOISELESS 1MEG
GVCCS6      35 MID VSENSE MID  -1U
C20         CLAMP MID 13.5N
R68         MID CLAMP R_NOISELESS 1MEG
R44         MID 36 R_NOISELESS 1MEG
XVCCS_LIM_1 46 27 MID 36 VCCS_LIM_1_0
Rdummy      MID 33 R_NOISELESS 25K
Rx          33 32 R_NOISELESS 250K
R56         MID 47 R_NOISELESS 1K
C15         47 48 1.592P
R55         48 47 R_NOISELESS 100MEG
GVCCS1      48 MID VCC_B MID  -100M
R54         MID 48 R_NOISELESS 1
R49         MID 49 R_NOISELESS 4.616K
C14         49 50 26.53P
R48         50 49 R_NOISELESS 100MEG
G_adjust    50 MID ESDp MID  -685.2M
Rsrc        MID 50 R_NOISELESS 1
XIQPos      VIMON MID MID VCC VCCS_LIMIT_IQ_0
XIQNeg      MID VIMON VEE MID VCCS_LIMIT_IQ_0
C_DIFF      ESDp ESDn 1P
XCL_AMP     51 52 VIMON MID 53 54 CLAMP_AMP_LO_0
SOR_SWp     CLAMP 55 CLAMP 55  S_VSWITCH_1
SOR_SWn     56 CLAMP 56 CLAMP  S_VSWITCH_2
XGR_AMP     57 58 59 MID 60 61 CLAMP_AMP_HI_0
R39         57 MID R_NOISELESS 1T
R37         58 MID R_NOISELESS 1T
R42         VSENSE 59 R_NOISELESS 1M
C19         59 MID 1F
R38         60 MID R_NOISELESS 1
R36         MID 61 R_NOISELESS 1
R40         60 62 R_NOISELESS 1M
R41         61 63 R_NOISELESS 1M
C17         62 MID 1F
C18         MID 63 1F
XGR_SRC     62 63 CLAMP MID VCCS_LIM_GR_0
R21         53 MID R_NOISELESS 1
R20         MID 54 R_NOISELESS 1
R29         53 64 R_NOISELESS 1M
R30         54 65 R_NOISELESS 1M
C9          64 MID 1F
C8          MID 65 1F
XCL_SRC     64 65 CL_CLAMP MID VCCS_LIM_4_0
R22         51 MID R_NOISELESS 1T
R19         MID 52 R_NOISELESS 1T
XCLAWp      VIMON MID 66 VCC_B VCCS_LIM_CLAW+_0
XCLAWn      MID VIMON VEE_B 67 VCCS_LIM_CLAW-_0
R12         66 VCC_B R_NOISELESS 1K
R16         66 68 R_NOISELESS 1M
R13         VEE_B 67 R_NOISELESS 1K
R17         69 67 R_NOISELESS 1M
C6          69 MID 1F
C5          MID 68 1F
G2          VCC_CLP MID 68 MID  -1M
R15         VCC_CLP MID R_NOISELESS 1K
G3          VEE_CLP MID 69 MID  -1M
R14         MID VEE_CLP R_NOISELESS 1K
XCLAW_AMP   VCC_CLP VEE_CLP VOUT_S MID 70 71 CLAMP_AMP_LO_0
R26         VCC_CLP MID R_NOISELESS 1T
R23         VEE_CLP MID R_NOISELESS 1T
R25         70 MID R_NOISELESS 1
R24         MID 71 R_NOISELESS 1
R27         70 72 R_NOISELESS 1M
R28         71 73 R_NOISELESS 1M
C11         72 MID 1F
C10         MID 73 1F
XCLAW_SRC   72 73 CLAW_CLAMP MID VCCS_LIM_3_0
H2          41 MID V11 -1
H3          39 MID V12 1
C12         SW_OL MID 100P
R32         74 SW_OL R_NOISELESS 100
R31         74 MID R_NOISELESS 1
XOL_SENSE   MID 74 40 38 OL_SENSE_0
S1          28 29 SW_OL MID  S_VSWITCH_3
H1          75 MID V4 1K
S7          VEE OUT VEE OUT  S_VSWITCH_4
S6          OUT VCC OUT VCC  S_VSWITCH_5
R11         MID 76 R_NOISELESS 1T
R18         76 VOUT_S R_NOISELESS 100
C7          VOUT_S MID 10P
E5          76 MID OUT MID  1
C13         VIMON MID 10P
R33         75 VIMON R_NOISELESS 100
R10         MID 75 R_NOISELESS 1T
R47         77 VCLP R_NOISELESS 100
C24         VCLP MID 100P
E4          77 MID CL_CLAMP MID  1
R46         MID CL_CLAMP R_NOISELESS 1K
G9          CL_CLAMP MID CLAW_CLAMP MID  -1M
R45         MID CLAW_CLAMP R_NOISELESS 1K
G8          CLAW_CLAMP MID 34 MID  -1M
R43         MID VSENSE R_NOISELESS 1K
G15         VSENSE MID CLAMP MID  -1M
C4          46 MID 1F
R9          46 78 R_NOISELESS 1M
R7          MID 79 R_NOISELESS 1T
R6          80 MID R_NOISELESS 1T
R8          MID 78 R_NOISELESS 1
XVCM_CLAMP  26 MID 78 MID 80 79 VCCS_EXT_LIM_0
E1          MID 0 81 0  1
R89         VEE_B 0 R_NOISELESS 1
R5          82 VEE_B R_NOISELESS 1M
C3          82 0 1F
R60         81 82 R_NOISELESS 1MEG
C1          81 0 1
R3          81 0 R_NOISELESS 1T
R59         83 81 R_NOISELESS 1MEG
C2          83 0 1F
R4          VCC_B 83 R_NOISELESS 1M
R88         VCC_B 0 R_NOISELESS 1
G17         VEE_B 0 VEE 0  -1
G16         VCC_B 0 VCC 0  -1
R_PSR       84 24 R_NOISELESS 1K
G_PSR       24 84 47 22  -1M
R2          25 ESDn R_NOISELESS 1M
R1          84 85 R_NOISELESS 1M
R_CMR       86 85 R_NOISELESS 1K
G_CMR       85 86 49 MID  -1M
C_CMn       ESDn MID 2P
C_CMp       MID ESDp 2P
R53         ESDn MID R_NOISELESS 1T
R52         MID ESDp R_NOISELESS 1T
R35         IN- ESDn R_NOISELESS 10M
R34         IN+ ESDp R_NOISELESS 10M
.MODEL S_VSWITCH_1 VSWITCH (RON=10M ROFF=1T VON=10M VOFF=0)
.MODEL S_VSWITCH_2 VSWITCH (RON=10M ROFF=1T VON=10M VOFF=0)
.MODEL S_VSWITCH_3 VSWITCH (RON=1M ROFF=1T VON=500M VOFF=100M)
.MODEL S_VSWITCH_4 VSWITCH (RON=50 ROFF=1T VON=500M VOFF=450M)
.MODEL S_VSWITCH_5 VSWITCH (RON=50 ROFF=1T VON=500M VOFF=450M)
.ENDS LMX58_LM2904
*
.SUBCKT PHASEREV_0  VCC VEE VIN+ VIN- VOUT+ VOUT- MID
E1 VOUT+ MID VALUE={IF(V(VIN+,MID)<V(VEE,MID)-0.3,V(VCC,MID),V(VIN+,MID))}
E2 VOUT- MID VALUE={IF(V(VIN-,MID)<V(VEE,MID)-0.3,V(VCC,MID),V(VIN-,MID))}
.ENDS
*
.SUBCKT CRS_DIST_0  VIMON MID OUT
V1 VREF MID -40M
ESHF VSHF MID VIMON VREF 1
GZC MID ZC VALUE = {SGN(V(VSHF,MID))}
R1 ZC MID 1
C1 ZC MID 2U
GCR MID OUT VALUE = {IF((ABS(V(ZC,MID))<=0.9),0,1)}
R2 OUT MID 1
.ENDS
*
.SUBCKT VCCS_LIM_ZO_0  VC+ VC- IOUT+ IOUT-
.PARAM GAIN = 4E3
.PARAM IPOS = 1E6
.PARAM INEG = -1E6
G1 IOUT+ IOUT- VALUE={LIMIT(GAIN*V(VC+,VC-),INEG,IPOS)}
.ENDS
*
.SUBCKT VCCS_LIM_2_EN_0  VC+ VC- IOUT+ IOUT- EN MID
.PARAM GAIN = 8.4E-4
.PARAM IPOS = 0.005
.PARAM INEG = -0.005
G1 IOUT+ IOUT- VALUE={LIMIT(GAIN*V(EN,MID)*V(VC+,VC-),INEG,IPOS)}
.ENDS
*
.SUBCKT FEMT_0  1 2
.PARAM FLWF=1E-3
.PARAM NLFF=500
.PARAM NVRF=500
.PARAM GLFF={PWR(FLWF,0.25)*NLFF/1164}
.PARAM RNVF={1.184*PWR(NVRF,2)}
.MODEL DVNF D KF={PWR(FLWF,0.5)/1E11} IS=1.0E-16
I1 0 7 10E-3
I2 0 8 10E-3
D1 7 0 DVNF
D2 8 0 DVNF
E1 3 6 7 8 {GLFF}
R1 3 0 1E9
R2 3 0 1E9
R3 3 6 1E9
E2 6 4 5 0 10
R4 5 0 {RNVF}
R5 5 0 {RNVF}
R6 3 4 1E9
R7 4 0 1E9
G1 1 2 3 4 1E-6
.ENDS
*
.SUBCKT VNSE_0  1 2
.PARAM FLW=10
.PARAM NLF=80
.PARAM NVR=35
.PARAM GLF={PWR(FLW,0.25)*NLF/1164}
.PARAM RNV={1.184*PWR(NVR,2)}
.MODEL DVN D KF={PWR(FLW,0.5)/1E11} IS=1.0E-16
I1 0 7 10E-3
I2 0 8 10E-3
D1 7 0 DVN
D2 8 0 DVN
E1 3 6 7 8 {GLF}
R1 3 0 1E9
R2 3 0 1E9
R3 3 6 1E9
E2 6 4 5 0 10
R4 5 0 {RNV}
R5 5 0 {RNV}
R6 3 4 1E9
R7 4 0 1E9
E3 1 2 3 4 1
.ENDS
*
.SUBCKT VCCS_LIM_1_0  VC+ VC- IOUT+ IOUT-
.PARAM GAIN = 1E-4
.PARAM IPOS = .5
.PARAM INEG = -.5
G1 IOUT+ IOUT- VALUE={LIMIT(GAIN*V(VC+,VC-),INEG,IPOS)}
.ENDS
*
.SUBCKT VCCS_LIMIT_IQ_0  VC+ VC- IOUT+ IOUT-
.PARAM GAIN = 1E-3
G1 IOUT- IOUT+ VALUE={IF( (V(VC+,VC-)<=0),0,GAIN*V(VC+,VC-) )}
.ENDS
*
.SUBCKT CLAMP_AMP_LO_0  VC+ VC- VIN COM VO+ VO-
.PARAM G=1
GVO+ COM VO+ VALUE = {IF(V(VIN,COM)>V(VC+,COM),((V(VIN,COM)-V(VC+,COM))*G),0)}
GVO- COM VO- VALUE = {IF(V(VIN,COM)<V(VC-,COM),((V(VC-,COM)-V(VIN,COM))*G),0)}
.ENDS
*
.SUBCKT CLAMP_AMP_HI_0  VC+ VC- VIN COM VO+ VO-
.PARAM G=10
GVO+ COM VO+ VALUE = {IF(V(VIN,COM)>V(VC+,COM),((V(VIN,COM)-V(VC+,COM))*G),0)}
GVO- COM VO- VALUE = {IF(V(VIN,COM)<V(VC-,COM),((V(VC-,COM)-V(VIN,COM))*G),0)}
.ENDS
*
.SUBCKT VCCS_LIM_GR_0  VC+ VC- IOUT+ IOUT-
.PARAM GAIN = 1
.PARAM IPOS = 0.013
.PARAM INEG = -0.013
G1 IOUT+ IOUT- VALUE={LIMIT(GAIN*V(VC+,VC-),INEG,IPOS)}
.ENDS
*
.SUBCKT VCCS_LIM_4_0  VC+ VC- IOUT+ IOUT-
.PARAM GAIN = 1
.PARAM IPOS = 1.04
.PARAM INEG = -1.04
G1 IOUT+ IOUT- VALUE={LIMIT(GAIN*V(VC+,VC-),INEG,IPOS)}
.ENDS
*
.SUBCKT VCCS_LIM_CLAW+_0  VC+ VC- IOUT+ IOUT-
G1 IOUT+ IOUT- TABLE {ABS(V(VC+,VC-))} =
+(0, 1.17E-03)
+(0.0046251, 1.17E-3)
+(0.15716, 1.21E-3)
+(1.3309, 1.28E-3)
+(35.075, 2.12E-3)
+(35.680, 2.55E-3)
+(36.033, 2.84E-3)
+(37.416, 7.97E-3)
.ENDS
*
.SUBCKT VCCS_LIM_CLAW-_0  VC+ VC- IOUT+ IOUT-
G1 IOUT+ IOUT- TABLE {ABS(V(VC+,VC-))} =
+(0.010, 2.50E-5)
+(0.070, 2.50E-5)
+(0.090, 5.80E-4)
+(0.100, 6.06E-4)
+(0.760, 7.14E-4)
+(1.440, 7.62E-4)
+(8.000, 1.10E-3)
+(13.60, 1.55E-3)
+(15.45, 1.75E-3)
+(17.26, 2.15E-3)
+(18.87, 2.94E-3)
+(21.58, 4.50E-3)
+(25.53, 1.02E-2)
.ENDS
*
.SUBCKT VCCS_LIM_3_0  VC+ VC- IOUT+ IOUT-
.PARAM GAIN = 1
.PARAM IPOS = 0.435
.PARAM INEG = -0.435
G1 IOUT+ IOUT- VALUE={LIMIT(GAIN*V(VC+,VC-),INEG,IPOS)}
.ENDS
*
.SUBCKT OL_SENSE_0  COM SW+ OLN  OLP
GSW+ COM SW+ VALUE = {IF((V(OLN,COM)>10E-3 | V(OLP,COM)>10E-3),1,0)}
.ENDS
*
.SUBCKT VCCS_EXT_LIM_0  VIN+ VIN- IOUT- IOUT+ VP+ VP-
.PARAM GAIN = 1
G1 IOUT+ IOUT- VALUE={LIMIT(GAIN*V(VIN+,VIN-),V(VP-,VIN-), V(VP+,VIN-))}
.ENDS
*
* This represents the ADC in the MSP432
* that switches between channels to measure each.
.param fadc=58000
.backanno
.end